# EAGLE design 7segdmux (EAGLE 6.6.0)
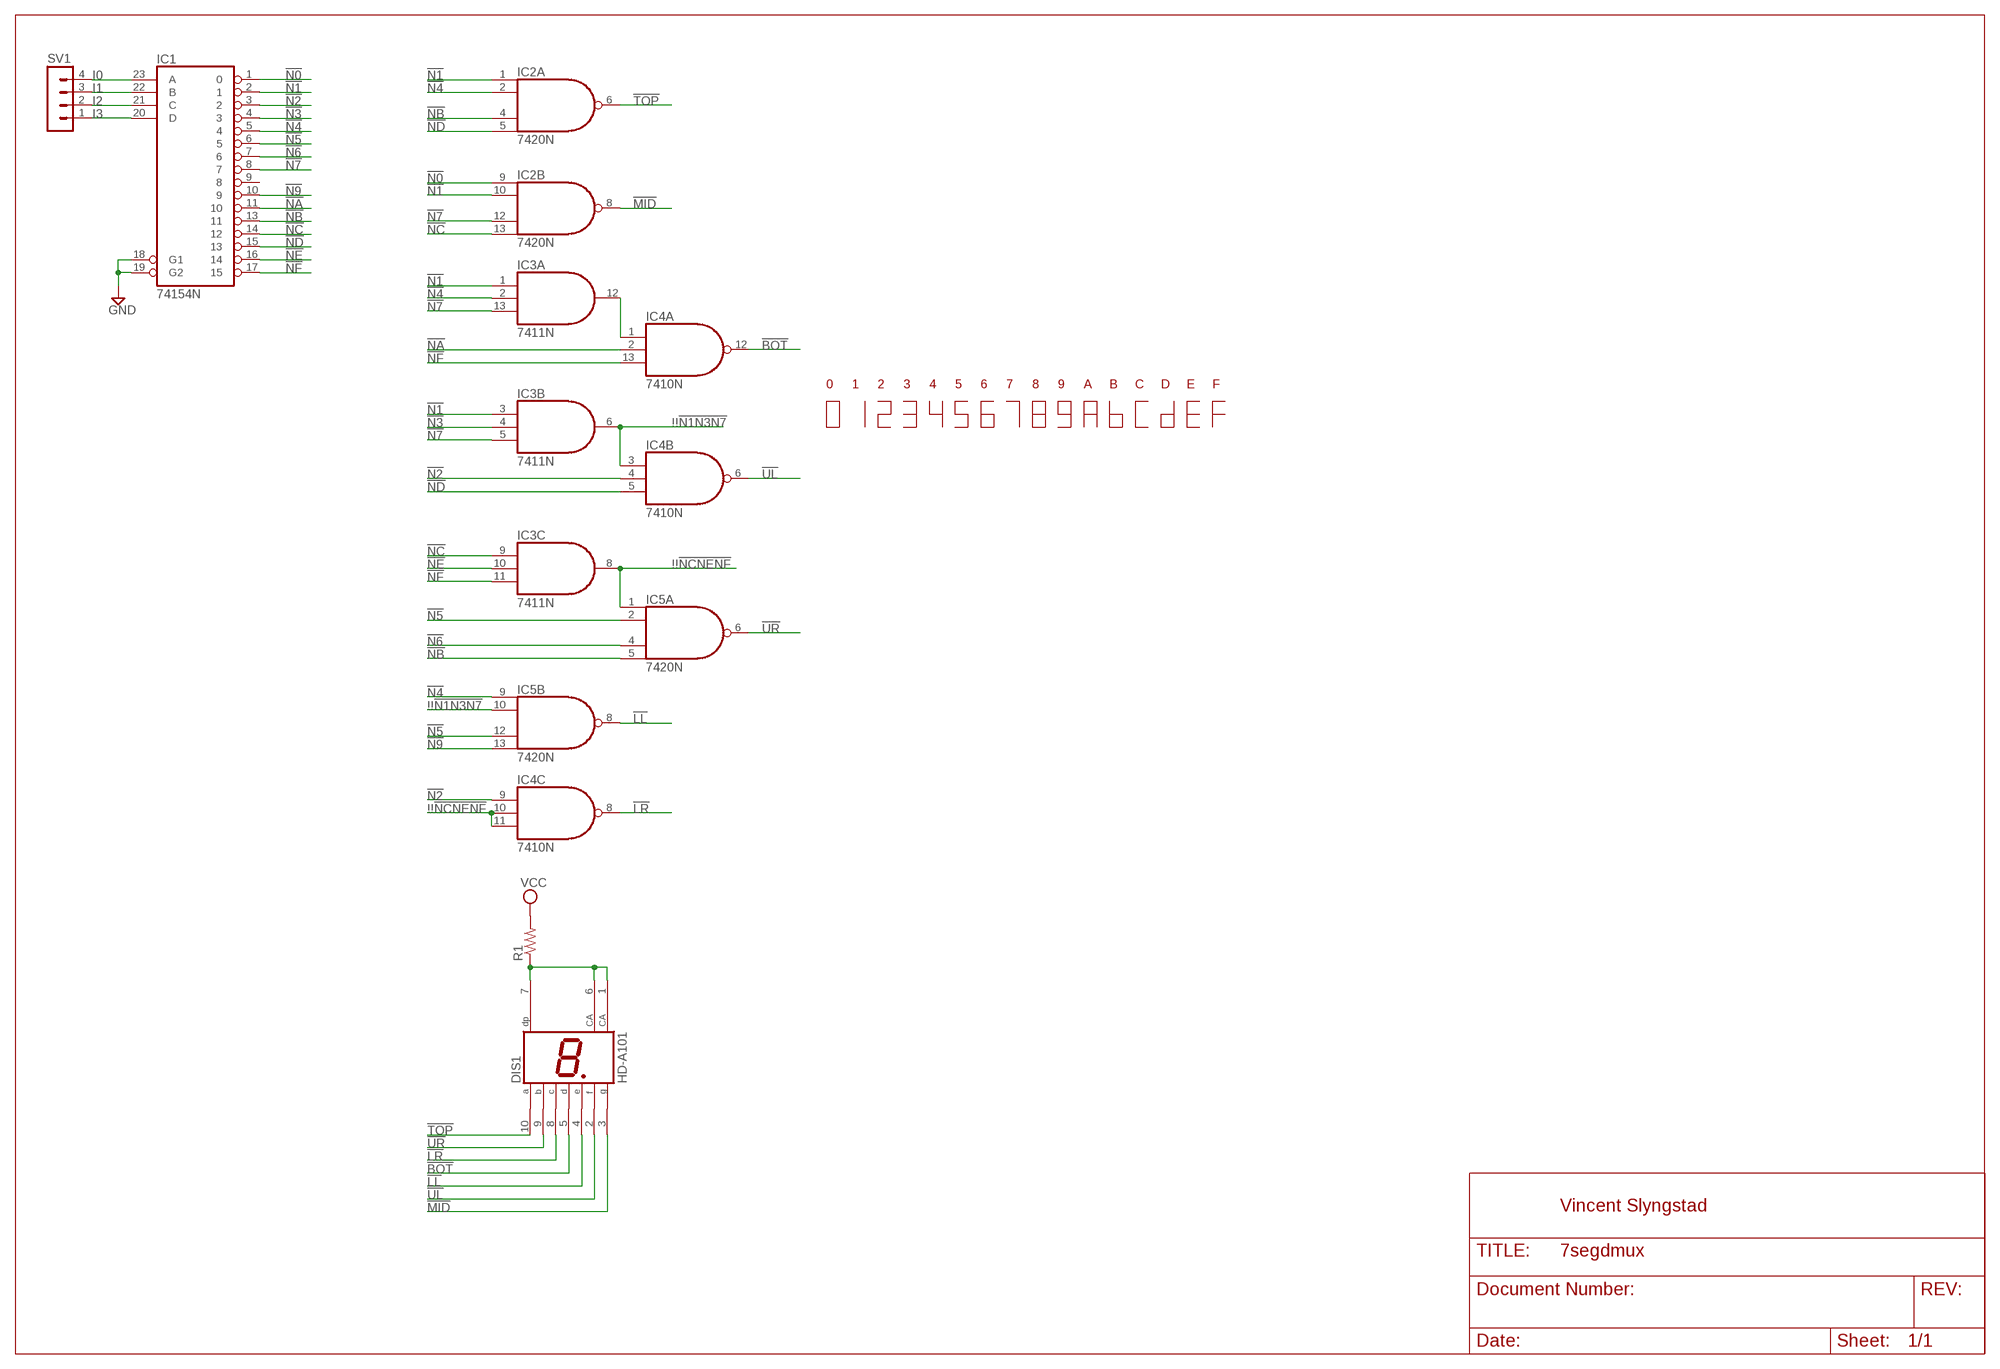
[diagram p0: schematic, sheet 1]

## Parts
DIS1  HD-A101  [HDSP-A]
IC1  74154N  [DIL24-6]
IC2  7420N  74S20N  [DIL14]
IC3  7411N  74S11N  [DIL14]
IC4  7410N  [DIL14]
IC5  7420N  74S20N  [DIL14]
R1  R-US_0207/10  [0207/10]
SV1  MA04-1  [MA04-1]

## Nets
!!!N1N3N7: IC3.6(B:O) IC4.3(B:I0) IC5.10(B:I1)
!!!NCNENF: IC3.8(C:O) IC4.10(C:I1) IC4.11(C:I2) IC5.1(A:I0)
!BOT: DIS1.5(D) IC4.12(A:O)
!LL: DIS1.4(E) IC5.8(B:O)
!LR: DIS1.8(C) IC4.8(C:O)
!MID: DIS1.3(G) IC2.8(B:O)
!N0: IC1.1 IC2.9(B:I0)
!N1: IC1.2 IC2.1(A:I0) IC2.10(B:I1) IC3.1(A:I0) IC3.3(B:I0)
!N2: IC1.3 IC4.4(B:I1) IC4.9(C:I0)
!N3: IC1.4 IC3.4(B:I1)
!N4: IC1.5 IC2.2(A:I1) IC3.2(A:I1) IC5.9(B:I0)
!N5: IC1.6 IC5.2(A:I1) IC5.12(B:I2)
!N6: IC1.7 IC5.4(A:I2)
!N7: IC1.8 IC2.12(B:I2) IC3.5(B:I2) IC3.13(A:I2)
!N9: IC1.10 IC5.13(B:I3)
!NA: IC1.11 IC4.2(A:I1)
!NB: IC1.13 IC2.4(A:I2) IC5.5(A:I3)
!NC: IC1.14 IC2.13(B:I3) IC3.9(C:I0)
!ND: IC1.15 IC2.5(A:I3) IC4.5(B:I2)
!NE: IC1.16 IC3.10(C:I1)
!NF: IC1.17 IC3.11(C:I2) IC4.13(A:I2)
!TOP: DIS1.10(A) IC2.6(A:O)
!UL: DIS1.2(F) IC4.6(B:O)
!UR: DIS1.9(B) IC5.6(A:O)
GND: IC1.18(G1) IC1.19(G2)
I0: IC1.23(A) SV1.4
I1: IC1.22(B) SV1.3
I2: IC1.21(C) SV1.2
I3: IC1.20(D) SV1.1
N$1: IC3.12(A:O) IC4.1(A:I0)
N$2: DIS1.1(CA) DIS1.6(CA) DIS1.7(DP) R1.1
VCC: R1.2
Unconnected: IC1.9

## Notes on the sheet
- 0 | 1 | 2 | 3 | 4 | 5 | 6 | 7 | 8 | 9 | A | B | C | D | E | F
- Vincent Slyngstad

## Power pins joined to a net without a drawn wire
GND: IC1.12(GND) IC2.7(P:GND) IC3.7(P:GND) IC4.7(P:GND) IC5.7(P:GND)
VCC: IC1.24(VCC) IC2.14(P:VCC) IC3.14(P:VCC) IC4.14(P:VCC) IC5.14(P:VCC)

## Library data of the parts
DIS1 = display-hp:HD-A101: LED DISPLAY 1-character 7 segment, decimal point right; OC_FARNELL: unknown; OC_NEWARK: unknown
IC1 = 74xx-us:74*154: 4-line to 16-line data SELECTOR/MULTIPLEXER
IC2 IC5 = 74xx-us:74*20: Dual 4-input NAND gate
IC3 = 74xx-us:74*11: Triple 3-input AND gate
IC4 = 74xx-us:74*10: Triple 3-input NAND gate
R1 = rcl:R-US_: RESISTOR, American symbol
SV1 = con-lstb:MA04-1: PIN HEADER; OC_FARNELL: unknown; OC_NEWARK: unknown

## Board
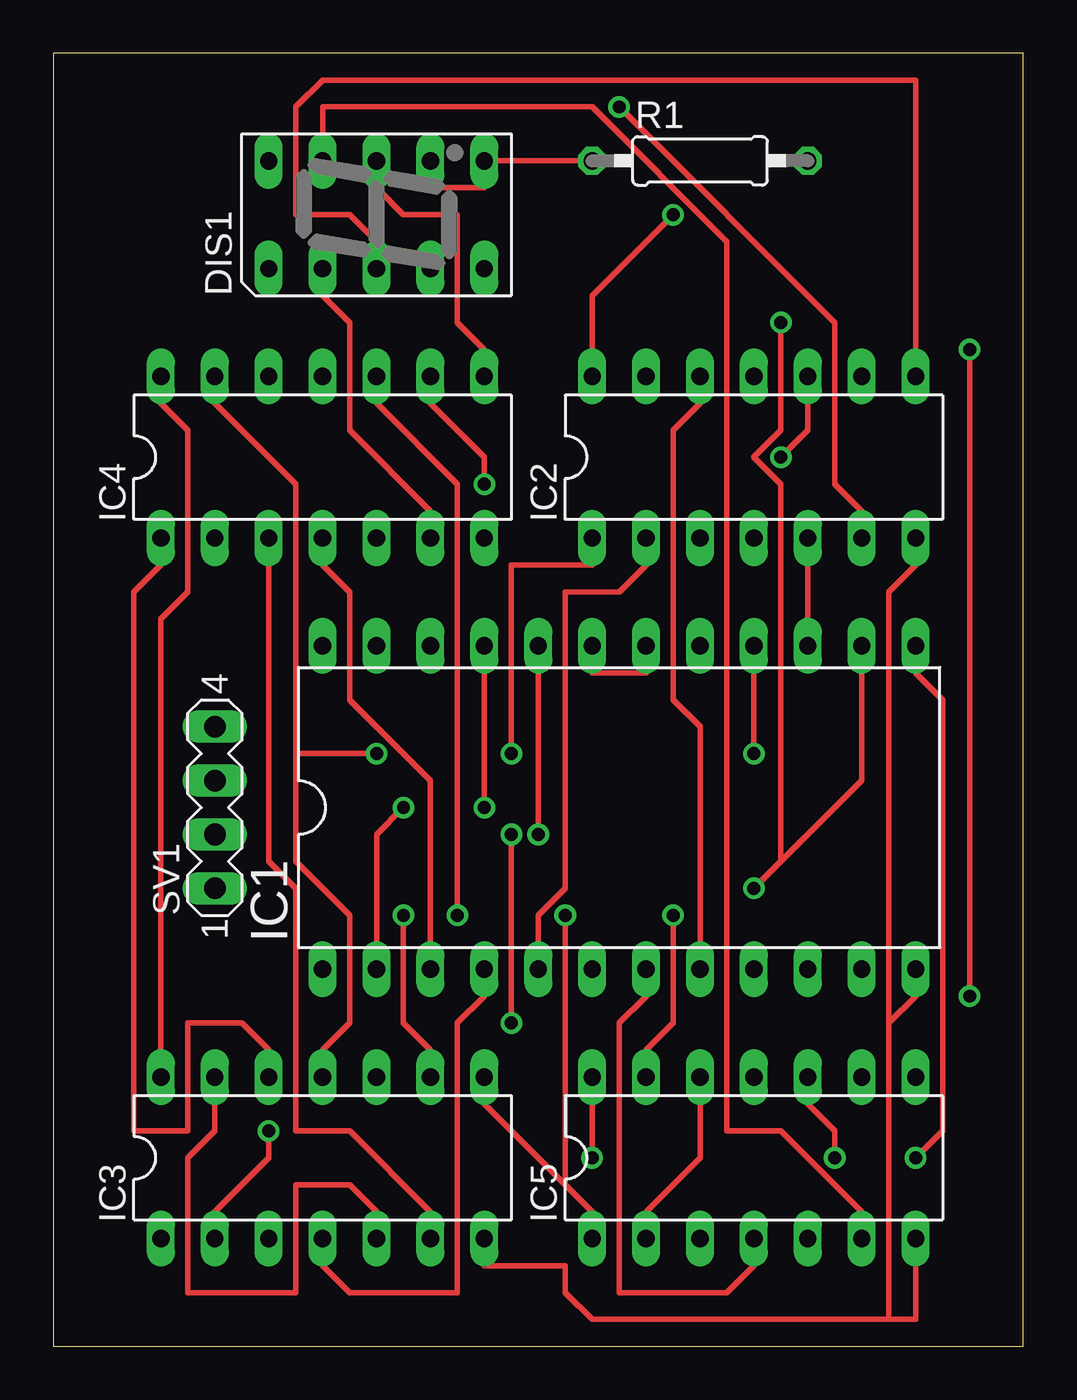
[diagram p1: board, top side]
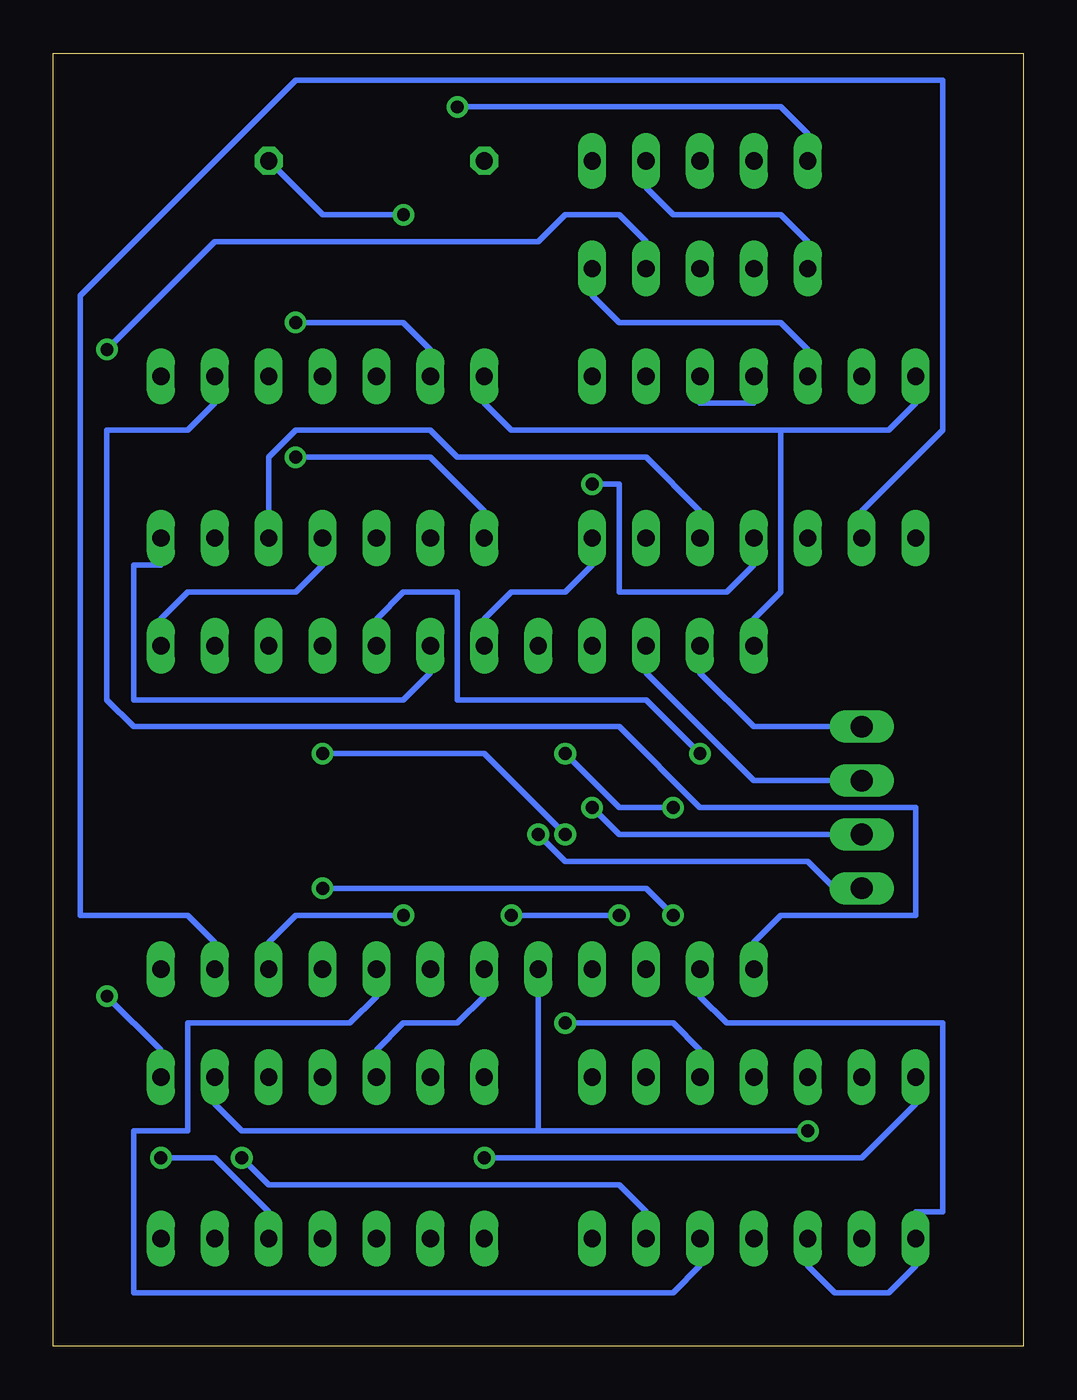
[diagram p2: board, bottom side, seen from below]

Size 45.72 x 60.96 mm. Coordinates in mm from the lower left corner, seen from the top.
Outline: 0,0 45.72,0 45.72,60.96 0,60.96 0,0
Copper layers (1*16): Top 0.035mm / dielectric 1.5mm / Bottom 0.035mm
Design rules "10mils": minimum track width 10mil, minimum drill 24mil, track to track 10mil, track to pad 10mil, pad to pad 10mil, via to via 10mil, smd to smd 10mil, copper to edge 25mil, drill to drill 10mil, minimum pad ring 10mil, minimum via ring 8mil, stop-mask expansion 0mil, vias tented up to drill 0mil, thermal gap 10mil

### Footprints (pad centres in the part's own frame; a part is rotated, then mirrored left to right if it is on the bottom)
HDSP-A = drill 0.813 long: 1 -2.54,5.08; 2 -2.54,2.54; 3 -2.54,0; 4 -2.54,-2.54; 5 -2.54,-5.08; 6 2.54,-5.08; 7 2.54,-2.54; 8 2.54,0; 9 2.54,2.54; 10 2.54,5.08
DIL24-6 = drill 0.813 long: 1 -13.97,-7.62; 2 -11.43,-7.62; 3 -8.89,-7.62; 4 -6.35,-7.62; 5 -3.81,-7.62; 6 -1.27,-7.62; 7 1.27,-7.62; 8 3.81,-7.62; 9 6.35,-7.62; 10 8.89,-7.62; 11 11.43,-7.62; 12 13.97,-7.62; 13 13.97,7.62; 14 11.43,7.62; 15 8.89,7.62; 16 6.35,7.62; 17 3.81,7.62; 18 1.27,7.62; 19 -1.27,7.62; 20 -3.81,7.62; 21 -6.35,7.62; 22 -8.89,7.62; 23 -11.43,7.62; 24 -13.97,7.62
DIL14 = drill 0.813 long: 1 -7.62,-3.81; 2 -5.08,-3.81; 3 -2.54,-3.81; 4 0,-3.81; 5 2.54,-3.81; 6 5.08,-3.81; 7 7.62,-3.81; 8 7.62,3.81; 9 5.08,3.81; 10 2.54,3.81; 11 0,3.81; 12 -2.54,3.81; 13 -5.08,3.81; 14 -7.62,3.81
0207/10 = drill 0.813 octagon: 1 -5.08,0; 2 5.08,0
MA04-1 = drill 1.016 long: 1 -3.81,0; 2 -1.27,0; 3 1.27,0; 4 3.81,0

### Placement (x,y rotation side)
DIS1  15.24,53.34 90 top
IC1  26.67,25.4 0 top
IC2  33.02,41.91 0 top
IC3  12.7,8.89 0 top
IC4  12.7,41.91 0 top
IC5  33.02,8.89 0 top
R1  30.48,55.88 0 top
SV1  7.62,25.4 90 top

### Tracks (layer width: path | path; a pad name or v marks a point on that pad's centre or on a via)
!!!N1N3N7  (via drill 0.61)
  Top 0.254: IC3.6 17.78,6.35 13.97,10.16 11.43,10.16 11.43,21.59 10.16,22.86 IC4.3 | v36.83,8.89 36.83,10.16 35.56,11.43 IC5.10
  Bottom 0.254: v36.83,8.89 35.56,7.62 19.05,7.62 17.78,6.35 IC3.6
!!!NCNENF  (via drill 0.61)
  Top 0.254: 24.13,7.62 25.4,6.35 IC5.1 | 24.13,7.62 20.32,11.43 IC3.8 | v19.05,20.32 19.05,40.64 15.24,44.45 IC4.10 | 24.13,7.62 v24.13,20.32
  Bottom 0.254: IC4.11 12.7,44.45 15.24,44.45 IC4.10 | v24.13,20.32 v19.05,20.32
!BOT
  Bottom 0.254: IC4.12 10.16,46.99 11.43,48.26 19.05,48.26 20.32,49.53 DIS1.5
!LL  (via drill 0.61)
  Top 0.254: v43.18,16.51 v43.18,46.99
  Bottom 0.254: v43.18,16.51 40.64,13.97 IC5.8 | v43.18,46.99 38.1,52.07 22.86,52.07 21.59,53.34 19.05,53.34 17.78,52.07 DIS1.4
!LR
  Top 0.254: DIS1.8 15.24,54.61 16.51,53.34 19.05,53.34 19.05,48.26 20.32,46.99 IC4.8
!MID
  Top 0.254: DIS1.3 15.24,52.07 13.97,53.34 11.43,53.34 11.43,58.42 12.7,59.69 40.64,59.69 IC2.8
!N0
  Bottom 0.254: IC1.1 12.7,19.05 11.43,20.32 5.08,20.32 5.08,25.4 15.24,25.4 19.05,29.21 41.91,29.21 43.18,30.48 43.18,43.18 39.37,43.18 38.1,44.45 IC2.9
!N1  (via drill 0.61)
  Top 0.254: v34.29,41.91 35.56,43.18 IC2.10 | v21.59,27.94 21.59,36.83 25.4,36.83 IC2.1 | v16.51,25.4 15.24,24.13 IC1.2
  Bottom 0.254: v34.29,41.91 27.94,41.91 25.4,39.37 IC2.1 | IC3.3 10.16,3.81 8.89,2.54 6.35,2.54 5.08,3.81 IC3.1 5.08,6.35 3.81,6.35 3.81,15.24 13.97,15.24 15.24,16.51 IC1.2 | v21.59,27.94 19.05,25.4 v16.51,25.4
!N2  (via drill 0.61)
  Top 0.254: IC1.3 17.78,26.67 13.97,30.48 13.97,35.56 12.7,36.83 IC4.4 | v20.32,40.64 20.32,41.91 17.78,44.45 IC4.9
  Bottom 0.254: v20.32,40.64 19.05,40.64 19.05,35.56 13.97,35.56 12.7,36.83 IC4.4
!N3
  Top 0.254: IC3.4 12.7,3.81 13.97,2.54 19.05,2.54 19.05,15.24 20.32,16.51 IC1.4
!N4  (via drill 0.61)
  Top 0.254: v10.16,10.16 10.16,8.89 7.62,6.35 IC3.2 | IC2.2 27.94,36.83 26.67,35.56 24.13,35.56 24.13,21.59 22.86,20.32 IC1.5
  Bottom 0.254: 22.86,10.16 36.83,10.16 38.1,11.43 IC5.9 | v10.16,10.16 22.86,10.16 | 22.86,10.16 IC1.5
!N5
  Top 0.254: IC5.2 27.94,6.35 30.48,8.89 IC5.12
  Bottom 0.254: IC1.6 25.4,16.51 26.67,15.24 29.21,15.24 30.48,13.97 IC5.12
!N6
  Top 0.254: IC5.4 33.02,3.81 31.75,2.54 26.67,2.54 26.67,15.24 27.94,16.51 IC1.7
!N7
  Top 0.254: IC3.5 15.24,6.35 13.97,7.62 11.43,7.62 11.43,2.54 6.35,2.54 6.35,8.89 7.62,10.16 IC3.13 | IC1.8 30.48,29.21 29.21,30.48 29.21,43.18 30.48,44.45 IC2.12
  Bottom 0.254: IC3.5 15.24,3.81 16.51,2.54 41.91,2.54 41.91,10.16 39.37,10.16 39.37,15.24 31.75,15.24 30.48,16.51 IC1.8
!N9  (via drill 0.61)
  Top 0.254: v29.21,20.32 29.21,15.24 27.94,13.97 IC5.13
  Bottom 0.254: v29.21,20.32 34.29,20.32 35.56,19.05 IC1.10
!NA
  Bottom 0.254: IC4.2 7.62,39.37 3.81,43.18 3.81,59.69 34.29,59.69 44.45,49.53 44.45,20.32 39.37,20.32 38.1,19.05 IC1.11
!NB  (via drill 0.61)
  Top 0.254: v40.64,8.89 41.91,10.16 41.91,30.48 40.64,31.75 IC1.13
  Bottom 0.254: v40.64,8.89 38.1,8.89 35.56,6.35 IC5.5 | IC2.4 33.02,36.83 34.29,35.56 39.37,35.56 40.64,34.29 IC1.13
!NC  (via drill 0.61)
  Top 0.254: v16.51,20.32 16.51,15.24 17.78,13.97 IC3.9 | 34.29,22.86 38.1,26.67 IC1.14 | v33.02,21.59 34.29,22.86 | v34.29,48.26 34.29,43.18 33.02,41.91 34.29,40.64 34.29,22.86
  Bottom 0.254: v16.51,20.32 17.78,21.59 v33.02,21.59 | v34.29,48.26 29.21,48.26 27.94,46.99 IC2.13
!ND
  Top 0.254: IC2.5 IC1.15
  Bottom 0.254: IC4.5 15.24,39.37 17.78,41.91 26.67,41.91 27.94,43.18 34.29,43.18 35.56,41.91 IC2.5
!NE  (via drill 0.61)
  Top 0.254: v21.59,15.24 v21.59,24.13 | v33.02,27.94 IC1.16
  Bottom 0.254: v21.59,15.24 16.51,15.24 15.24,13.97 IC3.10 | v21.59,24.13 25.4,27.94 v33.02,27.94
!NF  (via drill 0.61)
  Top 0.254: 11.43,27.94 11.43,22.86 13.97,20.32 13.97,15.24 12.7,13.97 IC3.11 | 11.43,27.94 11.43,40.64 7.62,44.45 IC4.13 | 11.43,27.94 v15.24,27.94
  Bottom 0.254: v15.24,27.94 17.78,30.48 26.67,30.48 26.67,35.56 29.21,35.56 30.48,34.29 IC1.17
!TOP  (via drill 0.61)
  Top 0.254: v26.67,58.42 36.83,48.26 36.83,40.64 38.1,39.37 IC2.6
  Bottom 0.254: v26.67,58.42 11.43,58.42 10.16,57.15 DIS1.10
!UL
  Top 0.254: IC4.6 17.78,39.37 13.97,43.18 13.97,48.26 12.7,49.53 DIS1.2
!UR
  Top 0.254: IC5.6 38.1,6.35 34.29,10.16 31.75,10.16 31.75,52.07 25.4,58.42 12.7,58.42 DIS1.9
GND
  Top 0.254: IC1.19 25.4,31.75 27.94,31.75 IC1.18 | 39.37,1.27 40.64,1.27 IC5.7 | 39.37,1.27 25.4,1.27 24.13,2.54 24.13,3.81 20.32,3.81 IC3.7 | 39.37,15.24 40.64,16.51 IC1.12 | 39.37,1.27 39.37,15.24 | 39.37,15.24 39.37,35.56 40.64,36.83 IC2.7
  Bottom 0.254: IC4.7 20.32,36.83 21.59,35.56 24.13,35.56 25.4,34.29 IC1.19 | IC1.18 27.94,31.75 29.21,30.48 41.91,30.48 41.91,36.83 40.64,36.83 IC2.7
I0
  Bottom 0.254: IC1.23 15.24,31.75 12.7,29.21 SV1.4
I1
  Bottom 0.254: IC1.22 17.78,31.75 12.7,26.67 SV1.3
I2  (via drill 0.61)
  Top 0.254: v20.32,25.4 IC1.21
  Bottom 0.254: v20.32,25.4 19.05,24.13 SV1.2
I3  (via drill 0.61)
  Top 0.254: v22.86,24.13 IC1.20
  Bottom 0.254: v22.86,24.13 21.59,22.86 10.16,22.86 8.89,21.59 SV1.1
N$1
  Top 0.254: IC3.12 10.16,13.97 8.89,15.24 6.35,15.24 6.35,10.16 3.81,10.16 3.81,35.56 5.08,36.83 IC4.1
N$2
  Top 0.254: DIS1.7 17.78,54.61 20.32,54.61 DIS1.6 R1.1
  Bottom 0.254: DIS1.1 10.16,52.07 11.43,53.34 16.51,53.34 17.78,54.61 DIS1.7
VCC  (via drill 0.61)
  Top 0.254: IC3.14 5.08,34.29 6.35,35.56 6.35,43.18 5.08,44.45 IC4.14 | v25.4,8.89 IC5.14 | v29.21,53.34 25.4,49.53 IC2.14
  Bottom 0.254: 11.43,43.18 11.43,35.56 12.7,34.29 IC1.24 | 11.43,43.18 6.35,43.18 5.08,44.45 IC4.14 | v25.4,8.89 7.62,8.89 5.08,11.43 IC3.14 | 11.43,43.18 24.13,43.18 25.4,44.45 IC2.14 | R1.2 33.02,53.34 v29.21,53.34